# Altium schematic sheet [SCH]_OldDriver.SchDoc
size A
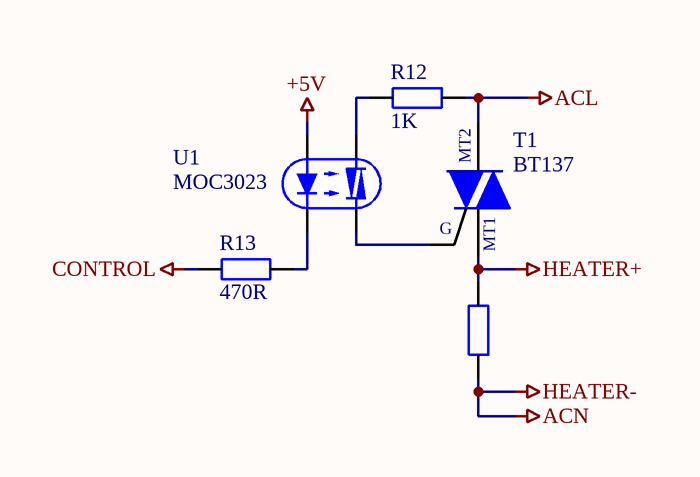
[diagram p0: [SCH]_OldDriver.SchDoc]

## Parts
R12  1K  [Res1/4W]
R13  470R  [Res1/4W]
SENSOR2  5R  [Res1/4W]  (value not drawn)
T1  BT137  [TO220H2]
U1  MOC3023  [DIL6-300b]

## Nets
+5V: U1.1(A)
ACL: R12.2 T1.2(MT2)
ACN: SENSOR2.1  [also labelled HEATER-]
CONTROL: R13.1
HEATER+: SENSOR2.2 T1.1(MT1)
NetR12_1: R12.1 U1.6(A2)
NetR13_2: R13.2 U1.2(C)
NetT1_3: T1.3(IN) U1.4(A1)

## Notes on the sheet
- (in symbol BT137) G

## Library data of the parts
R12 R13 SENSOR2 = Res 1/4W: Resistor 1/4W
T1 = BT137: Triacs - 8A; Value: LM317
U1 = MOC3023: Price: 0.82